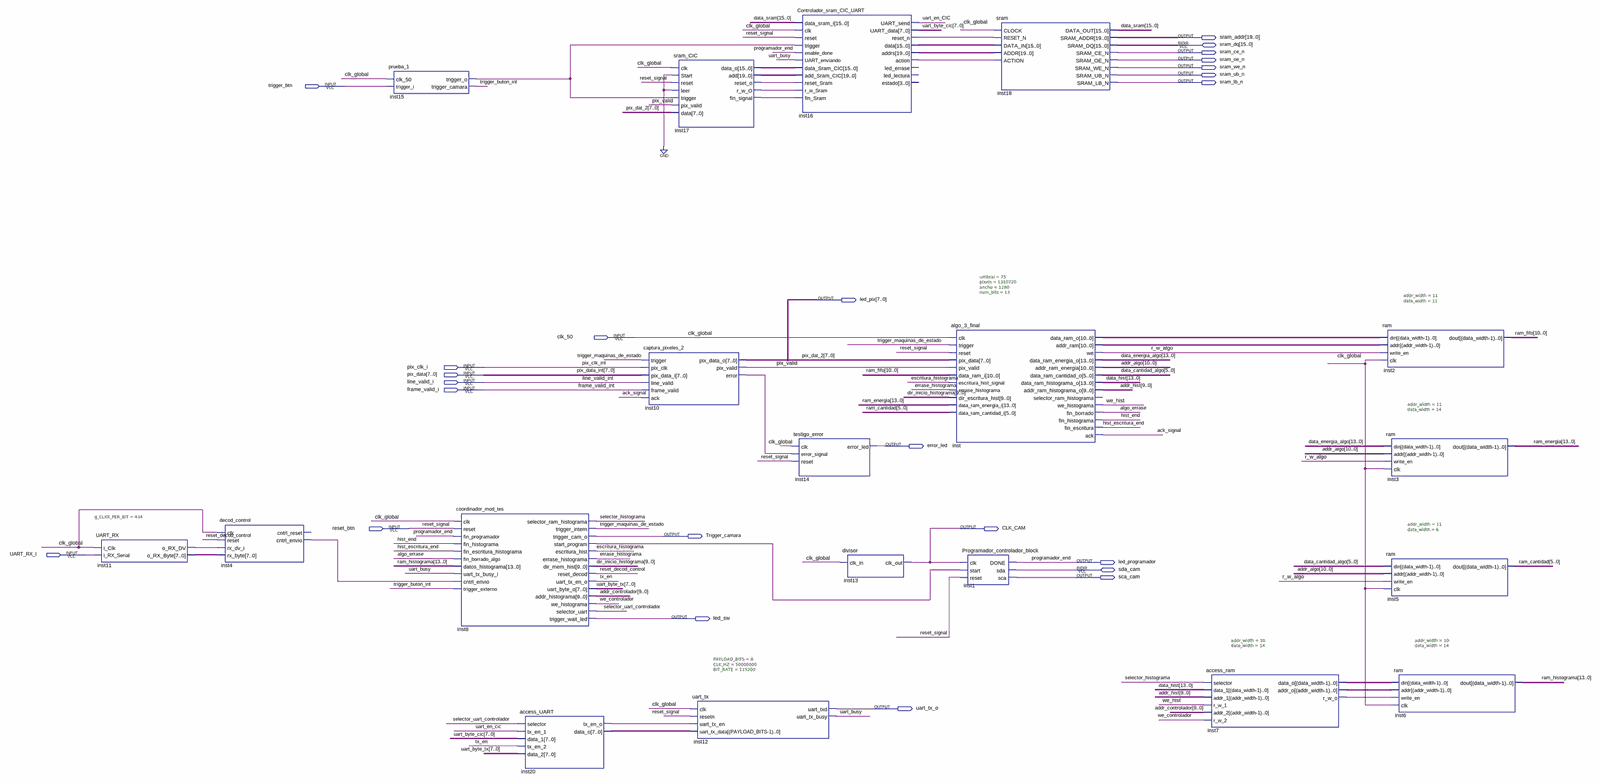
[diagram p0: schematic sheet, whole]
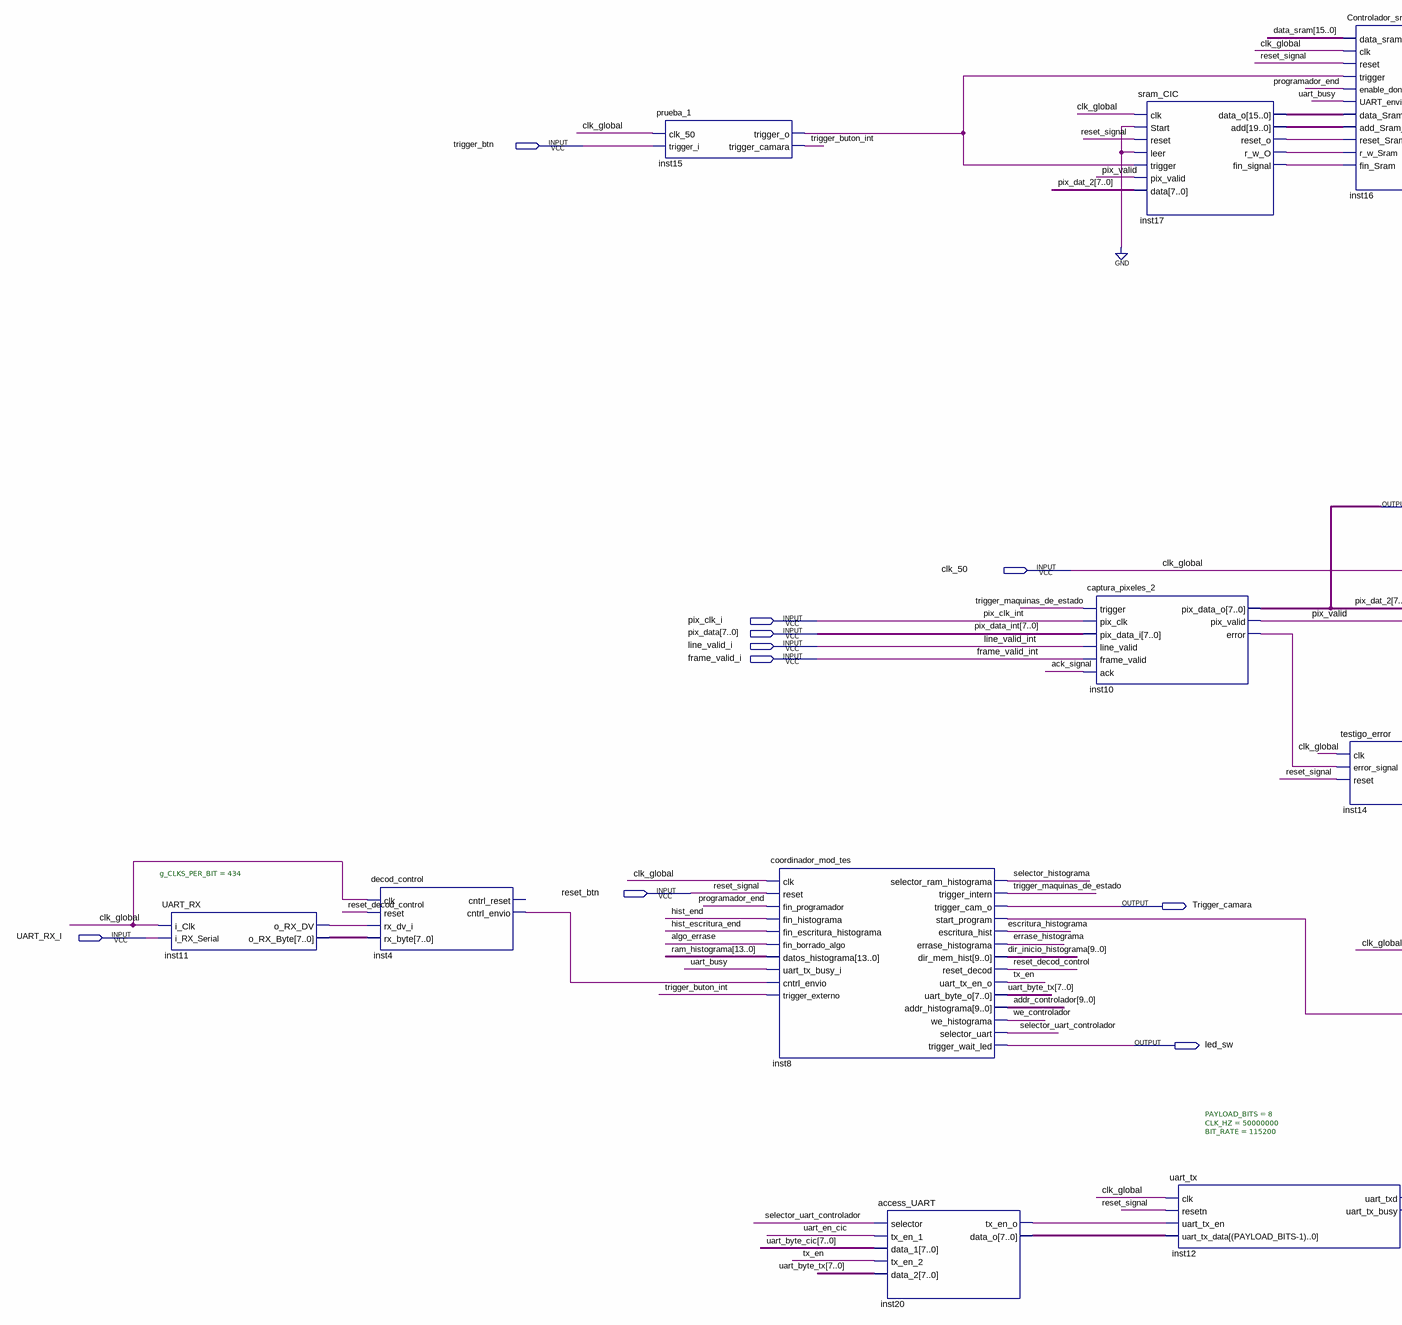
[diagram p1: schematic sheet, left part]
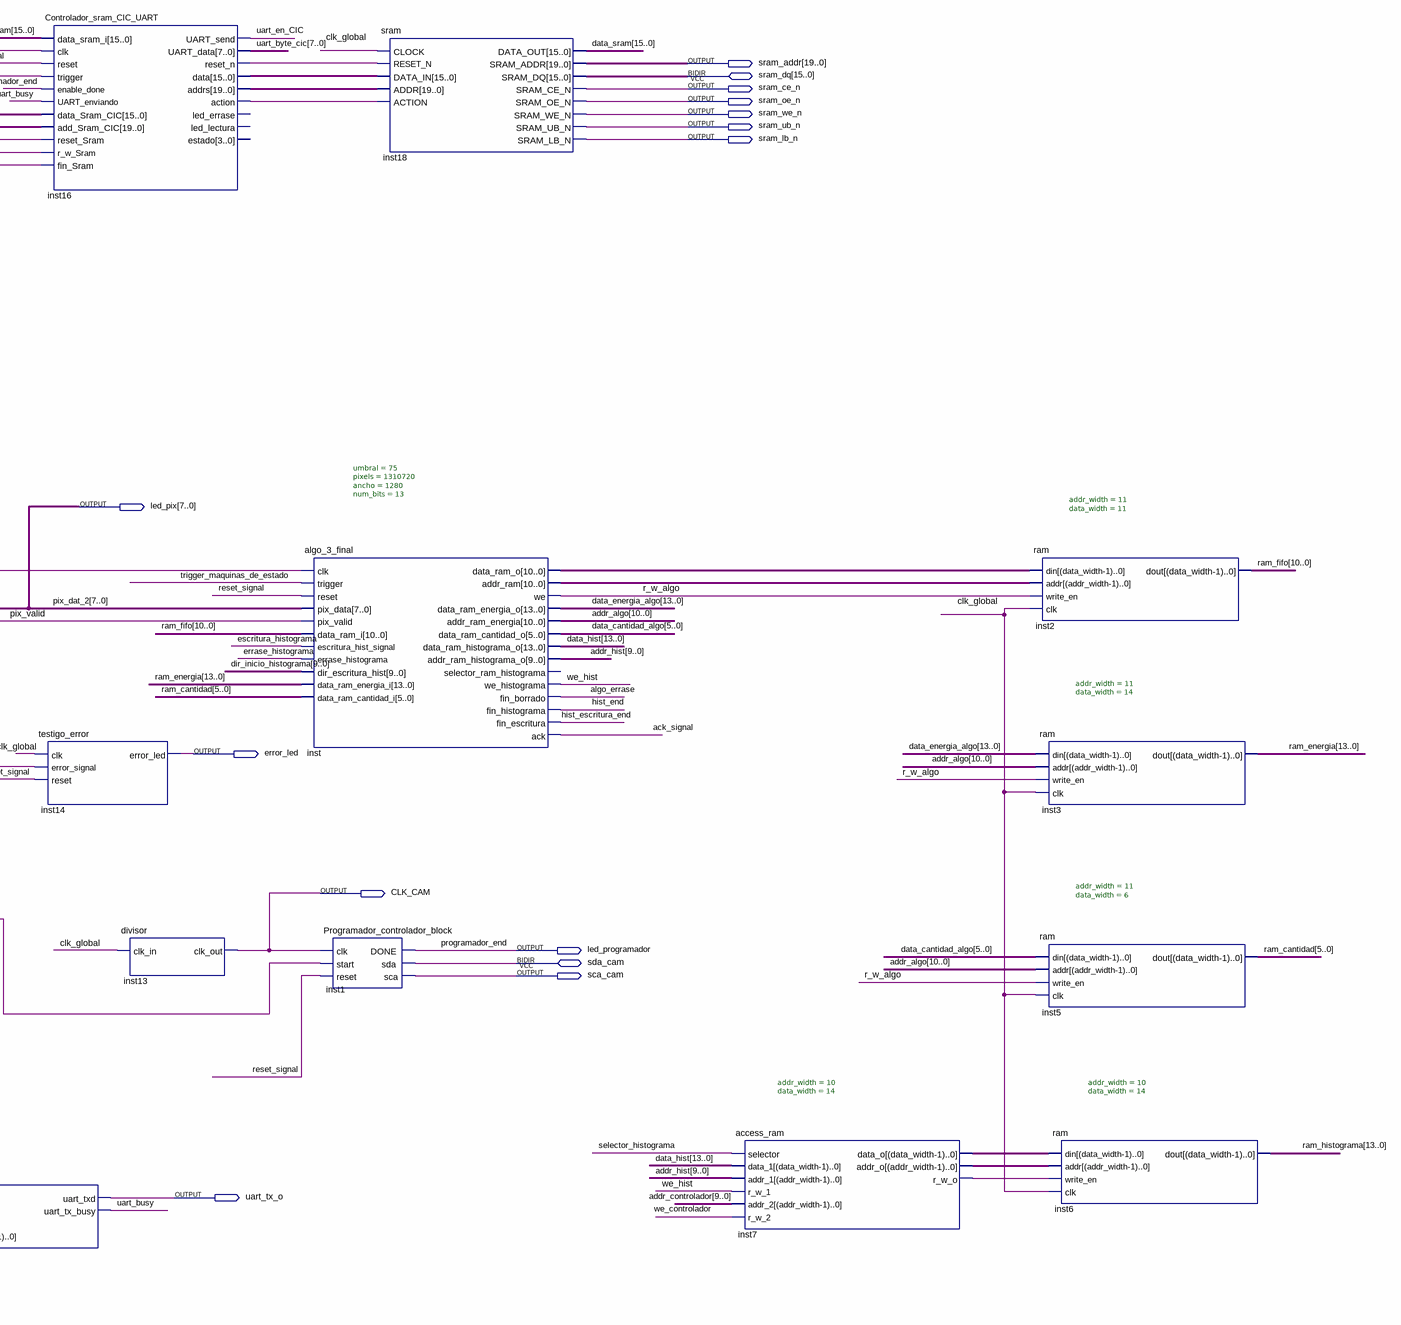
[diagram p2: schematic sheet, right part]
// Quartus schematic banco_de_pruebas_simplificado.bdf as structural Verilog: 19 symbols, 24 pins
module banco_de_pruebas_simplificado (
  input  trigger_btn,
  input  clk_50,
  input  pix_clk_i,
  input  [7:0] pix_data,
  input  line_valid_i,
  input  frame_valid_i,
  input  reset_btn,
  input  UART_RX_I,
  inout  [15:0] sram_dq,
  inout  sda_cam,
  output [19:0] sram_addr,
  output sram_ce_n,
  output sram_oe_n,
  output sram_we_n,
  output sram_ub_n,
  output sram_lb_n,
  output [7:0] led_pix,
  output error_led,
  output CLK_CAM,
  output Trigger_camara,
  output led_programador,
  output sca_cam,
  output led_sw,
  output uart_tx_o
);

  wire ack_signal, algo_errase, errase_histograma, escritura_histograma, hist_end, hist_escritura_end,
       inst4_cntrl_envio, inst7_r_w_o, inst8_start_program, inst10_error, inst11_o_rx_dv, inst15_trigger_o,
       inst16_action, inst16_reset_n, inst17_fin_signal, inst17_r_w_o, inst17_reset_o, inst20_tx_en_o,
       pix_valid, r_w_algo, reset_decod_control, selector_histograma, selector_uart_controlador,
       trigger_buton_int, trigger_maquinas_de_estado, tx_en, uart_busy, uart_en_CIC, we_controlador, we_hist;
  wire [5:0] data_cantidad_algo, ram_cantidad;
  wire [7:0] inst11_o_rx_byte, inst20_data_o, uart_byte_cic, uart_byte_tx;
  wire [9:0] addr_controlador, addr_hist, dir_inicio_histograma, inst7_addr_o;
  wire [10:0] addr_algo, inst_addr_ram, inst_data_ram_o, ram_fifo;
  wire [13:0] data_energia_algo, data_hist, inst7_data_o, ram_energia, ram_histograma;
  wire [15:0] data_sram, inst16_data, inst17_data_o;
  wire [19:0] inst16_addrs, inst17_add;

  UART_RX #(.g_CLKS_PER_BIT(434)) inst11 (
    .i_Clk(clk_50), .i_RX_Serial(UART_RX_I), .o_RX_DV(inst11_o_rx_dv), .o_RX_Byte(inst11_o_rx_byte));
  decod_control inst4 (
    .clk(clk_50), .reset(reset_decod_control), .rx_dv_i(inst11_o_rx_dv), .rx_byte(inst11_o_rx_byte),
    .cntrl_envio(inst4_cntrl_envio));  // open: cntrl_reset
  prueba_1 inst15 (
    .clk_50(clk_50), .trigger_i(trigger_btn), .trigger_o(inst15_trigger_o), .trigger_camara(trigger_buton_int));
  coordinador_mod_tes inst8 (
    .clk(clk_50), .reset(reset_btn), .fin_programador(led_programador), .fin_histograma(hist_end),
    .fin_escritura_histograma(hist_escritura_end), .fin_borrado_algo(algo_errase),
    .datos_histograma(ram_histograma), .uart_tx_busy_i(uart_busy), .cntrl_envio(inst4_cntrl_envio),
    .trigger_externo(trigger_buton_int), .selector_ram_histograma(selector_histograma),
    .trigger_intern(trigger_maquinas_de_estado), .trigger_cam_o(Trigger_camara),
    .start_program(inst8_start_program), .escritura_hist(escritura_histograma),
    .errase_histograma(errase_histograma), .dir_mem_hist(dir_inicio_histograma),
    .reset_decod(reset_decod_control), .uart_tx_en_o(tx_en), .uart_byte_o(uart_byte_tx),
    .addr_histograma(addr_controlador), .we_histograma(we_controlador),
    .selector_uart(selector_uart_controlador), .trigger_wait_led(led_sw));
  access_UART inst20 (
    .selector(selector_uart_controlador), .tx_en_1(uart_en_CIC), .data_1(uart_byte_cic), .tx_en_2(tx_en),
    .data_2(uart_byte_tx), .tx_en_o(inst20_tx_en_o), .data_o(inst20_data_o));
  captura_pixeles_2 inst10 (
    .trigger(trigger_maquinas_de_estado), .pix_clk(pix_clk_i), .pix_data_i(pix_data),
    .line_valid(line_valid_i), .frame_valid(frame_valid_i), .ack(ack_signal), .pix_data_o(led_pix),
    .pix_valid(pix_valid), .error(inst10_error));
  sram_CIC inst17 (
    .clk(clk_50), .Start(1'b0), .reset(reset_btn), .leer(1'b0), .trigger(inst15_trigger_o),
    .pix_valid(pix_valid), .data(led_pix), .data_o(inst17_data_o), .add(inst17_add),
    .reset_o(inst17_reset_o), .r_w_O(inst17_r_w_o), .fin_signal(inst17_fin_signal));
  uart_tx #(.PAYLOAD_BITS(8), .CLK_HZ(50000000), .BIT_RATE(115200)) inst12 (
    .clk(clk_50), .resetn(reset_btn), .uart_tx_en(inst20_tx_en_o), .uart_tx_data(inst20_data_o),
    .uart_txd(uart_tx_o), .uart_tx_busy(uart_busy));
  Controlador_sram_CIC_UART inst16 (
    .data_sram_i(data_sram), .clk(clk_50), .reset(reset_btn), .trigger(inst15_trigger_o),
    .enable_done(led_programador), .UART_enviando(uart_busy), .data_Sram_CIC(inst17_data_o),
    .add_Sram_CIC(inst17_add), .reset_Sram(inst17_reset_o), .r_w_Sram(inst17_r_w_o),
    .fin_Sram(inst17_fin_signal), .UART_send(uart_en_CIC), .UART_data(uart_byte_cic),
    .reset_n(inst16_reset_n), .data(inst16_data), .addrs(inst16_addrs), .action(inst16_action));  // open: led_errase, led_lectura, estado
  testigo_error inst14 (.clk(clk_50), .error_signal(inst10_error), .reset(reset_btn), .error_led(error_led));
  divisor inst13 (.clk_in(clk_50), .clk_out(CLK_CAM));
  algo_3_final #(.umbral(75), .pixels(1310720), .ancho(1280), .num_bits(13)) inst (
    .clk(clk_50), .trigger(trigger_maquinas_de_estado), .reset(reset_btn), .pix_data(led_pix),
    .pix_valid(pix_valid), .data_ram_i(ram_fifo), .escritura_hist_signal(escritura_histograma),
    .errase_histograma(errase_histograma), .dir_escritura_hist(dir_inicio_histograma),
    .data_ram_energia_i(ram_energia), .data_ram_cantidad_i(ram_cantidad), .data_ram_o(inst_data_ram_o),
    .addr_ram(inst_addr_ram), .we(r_w_algo), .data_ram_energia_o(data_energia_algo),
    .addr_ram_energia(addr_algo), .data_ram_cantidad_o(data_cantidad_algo),
    .data_ram_histograma_o(data_hist), .addr_ram_histograma_o(addr_hist), .we_histograma(we_hist),
    .fin_borrado(algo_errase), .fin_histograma(hist_end), .fin_escritura(hist_escritura_end), .ack(ack_signal));  // open: selector_ram_histograma
  Programador_controlador_block inst1 (
    .clk(CLK_CAM), .start(inst8_start_program), .reset(reset_btn), .DONE(led_programador), .sca(sca_cam),
    .sda(sda_cam));
  sram inst18 (
    .CLOCK(clk_50), .RESET_N(inst16_reset_n), .DATA_IN(inst16_data), .ADDR(inst16_addrs),
    .ACTION(inst16_action), .DATA_OUT(data_sram), .SRAM_ADDR(sram_addr), .SRAM_CE_N(sram_ce_n),
    .SRAM_OE_N(sram_oe_n), .SRAM_WE_N(sram_we_n), .SRAM_UB_N(sram_ub_n), .SRAM_LB_N(sram_lb_n),
    .SRAM_DQ(sram_dq));
  access_ram #(.addr_width(10), .data_width(14)) inst7 (
    .selector(selector_histograma), .data_1(data_hist), .addr_1(addr_hist), .r_w_1(we_hist),
    .addr_2(addr_controlador), .r_w_2(we_controlador), .data_o(inst7_data_o), .addr_o(inst7_addr_o),
    .r_w_o(inst7_r_w_o));
  ram #(.addr_width(11), .data_width(11)) inst2 (
    .din(inst_data_ram_o), .addr(inst_addr_ram), .write_en(r_w_algo), .clk(clk_50), .dout(ram_fifo));
  ram #(.addr_width(11), .data_width(14)) inst3 (
    .din(data_energia_algo), .addr(addr_algo), .write_en(r_w_algo), .clk(clk_50), .dout(ram_energia));
  ram #(.addr_width(11), .data_width(6)) inst5 (
    .din(data_cantidad_algo), .addr(addr_algo), .write_en(r_w_algo), .clk(clk_50), .dout(ram_cantidad));
  ram #(.addr_width(10), .data_width(14)) inst6 (
    .din(inst7_data_o), .addr(inst7_addr_o), .write_en(inst7_r_w_o), .clk(clk_50), .dout(ram_histograma));

  // Other names for the same wires on the sheet: clk_global = clk_50; frame_valid_int = frame_valid_i;
  //   line_valid_int = line_valid_i; pix_clk_int = pix_clk_i; pix_dat_2[7:0] = led_pix; pix_data_int[7:0] = pix_data;
  //   programador_end = led_programador; reset_signal = reset_btn
endmodule
